# Altium project MotorBoard .PrjPcb
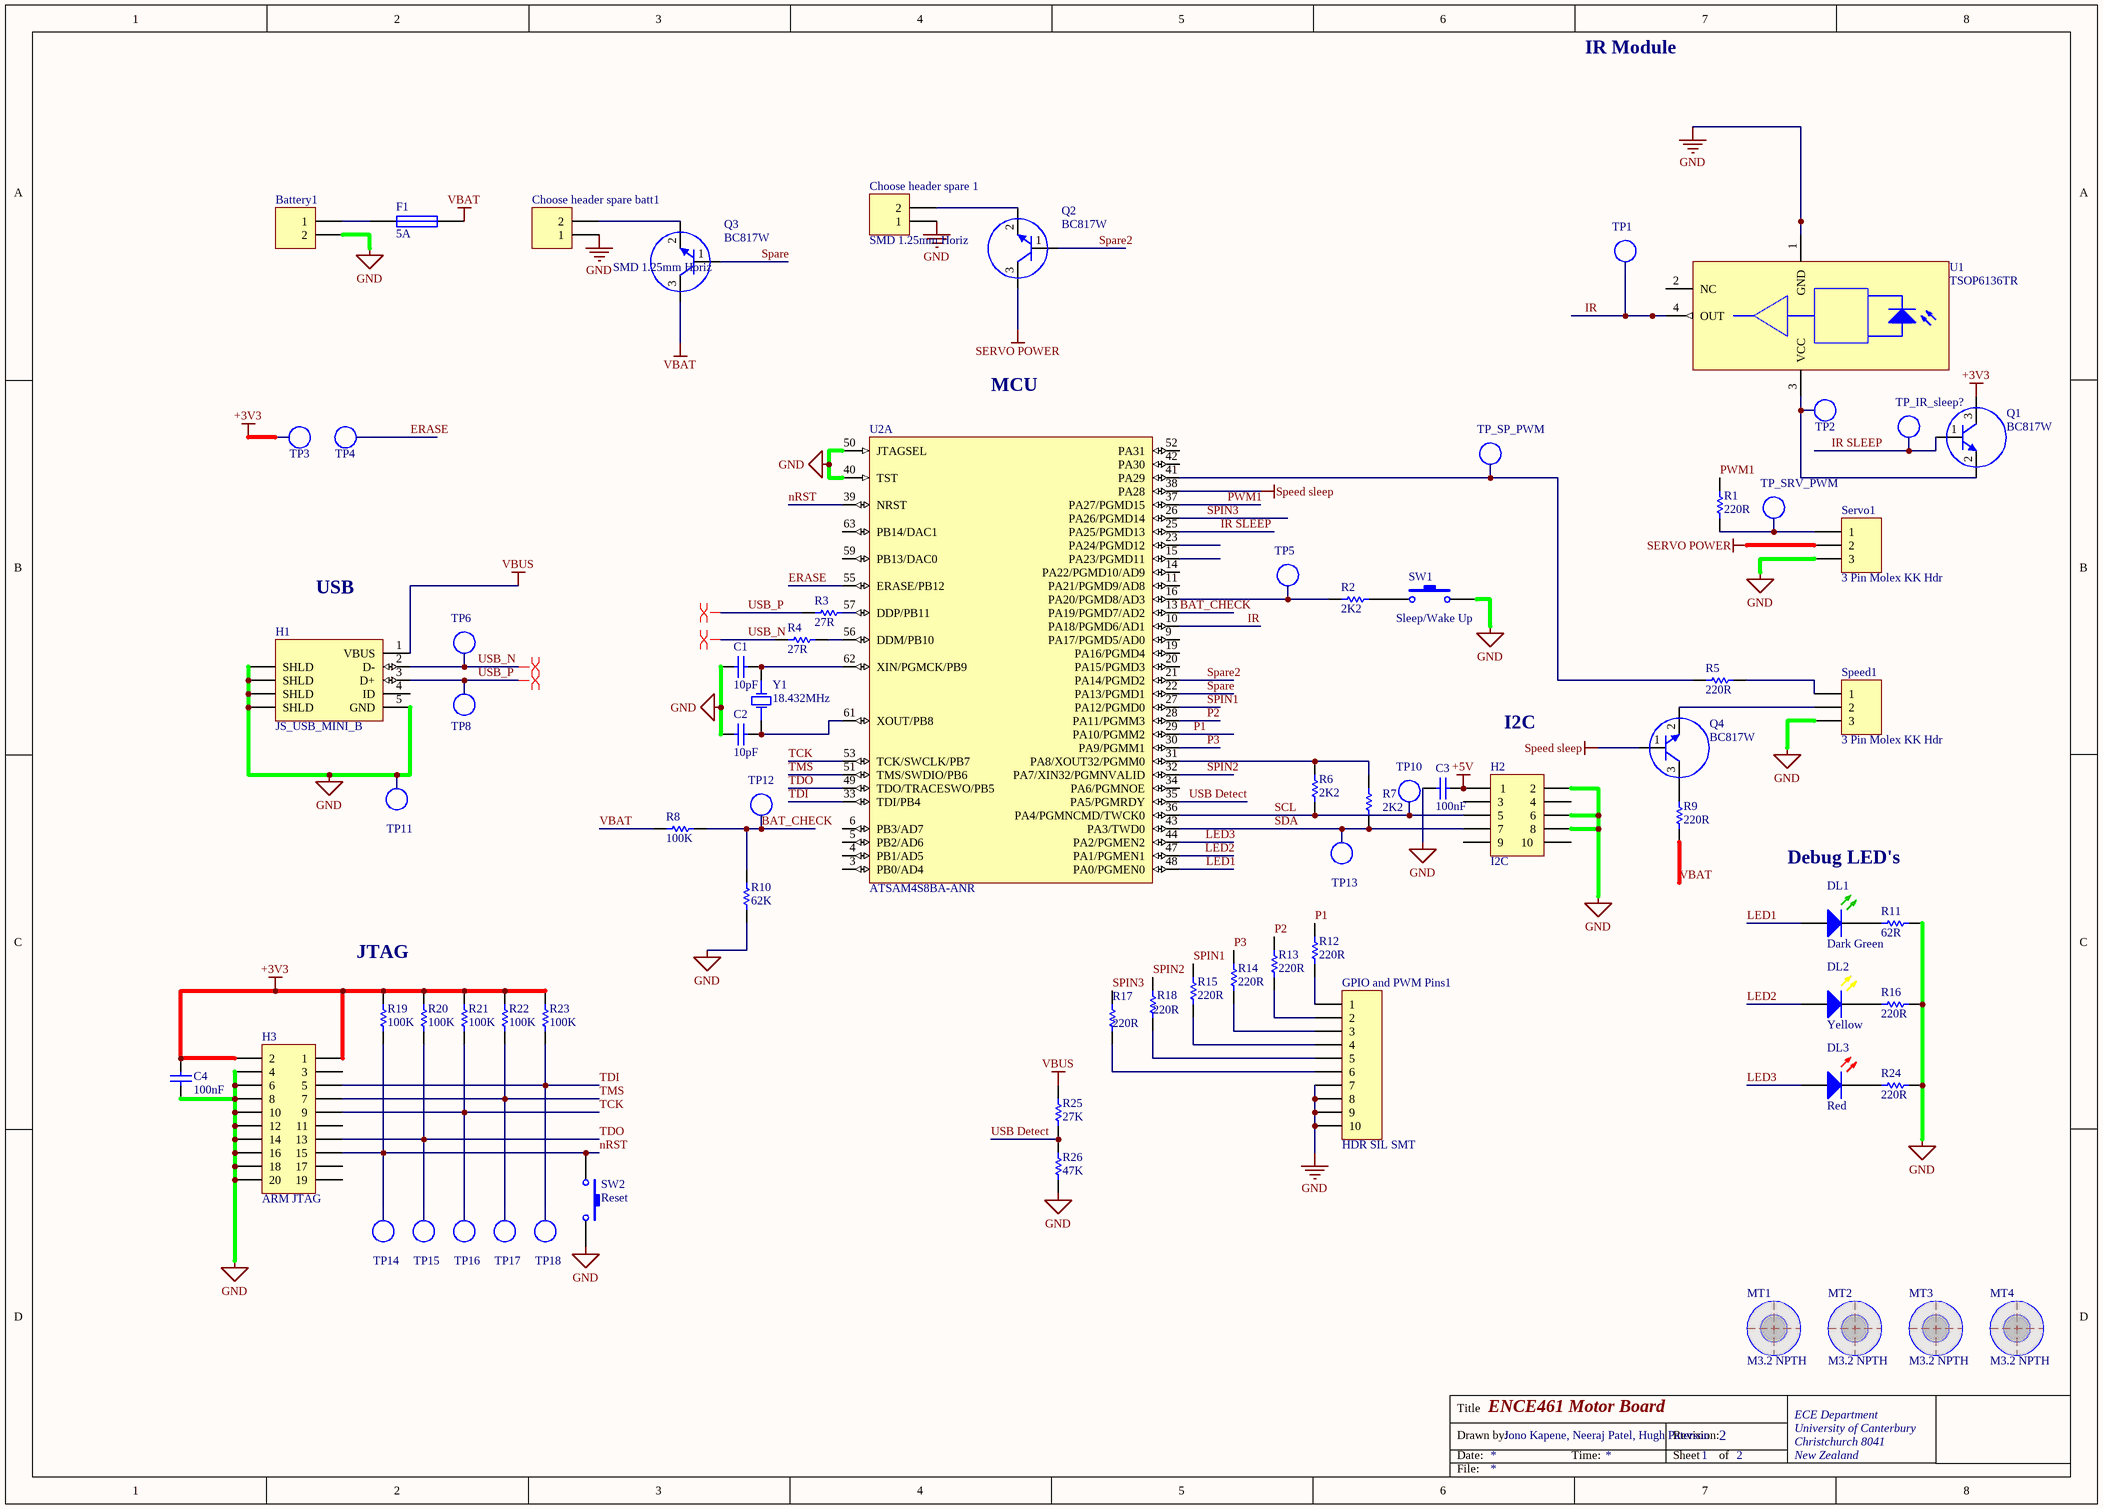
[diagram p0: MotorBoard.SchDoc]
2 sheets, 113 parts. Net scope: global (net labels, ports and power ports of the same name join across sheets).
Board files: Take 3 85 X 80mm.PcbDoc, MotorBoard.PcbDoc, real man's pcb.PcbDoc
Sheets:
  MotorBoard.SchDoc
  MotorBoard_PowerDistribution.SchDoc

## Sheet MotorBoard.SchDoc: ENCE461 Motor Board
size A3; DrawnBy: Jono Kapene, Neeraj Patel, Hugh Paterson; Address1: ECE Department; Address2: University of Canterbury; Address3: Christchurch 8041; Address4: New Zealand; Revision: 2; SheetNumber: 1; SheetTotal: 2; PageSetup: Record=PageOptions|CenterHorizontal=True|CenterVertical=True|PrintScale=1.01|XCorrection=1.00|YCorrection=1.00|PrintKind=0|BorderSize=5000000|LeftOffset=0|BottomOffset=0|Orientation=2|PaperLength=4200|PaperWidth=2970|Scale=100|PaperSource=7|PrintQuality=600|MediaType=1|DitherType=10|PrintScaleMode=1|PaperKind=A3 (297 x 420 mm)|PaperIndex=8

### Parts
Battery1  JA_TERM_BLK_HDR_2 PIN  [TMHDR2]  (value not drawn)
C1  10pF  [CAPC1608L]
C2  10pF  [CAPC1608L]
C3  100nF  [CAPC1608L]
C4  100nF  [CAPC1608L]
Choose_header_spare_1  SMD 1.25mm Horiz  [SD-53261-0219]
Choose_header_spare_batt1  SMD 1.25mm Horiz  [SD-53261-0219]
DL1  Dark Green  [WL-SMCW0603]
DL2  Yellow  [WL-SMCW0603]
DL3  Red  [WL-SMCW0603]
F1  5A  [RESC3216N]
GPIO_and_PWM_Pins1  HDR SIL SMT  [M52-040000P1045]
H1  JS_USB_MINI_B  [USB/SM0.8-6H5]
H2  I2C  [188275-10]
H3  ARM JTAG  [188275-20]
IR_sleep  USB_N  [TP_0805]  (value not drawn)
MT1  M3.2 NPTH  [MNT-HOLE_3.2mm_NPTH]  (no BOM)
MT2  M3.2 NPTH  [MNT-HOLE_3.2mm_NPTH]  (no BOM)
MT3  M3.2 NPTH  [MNT-HOLE_3.2mm_NPTH]  (no BOM)
MT4  M3.2 NPTH  [MNT-HOLE_3.2mm_NPTH]  (no BOM)
Q1  BC817W  [SOT323_M]
Q2  BC817W  [SOT323_M]
Q3  BC817W  [SOT323_M]
Q4  BC817W  [SOT323_M]
R1  220R  [RESC1608L]
R2  2K2  [RESC1608L]
R3  27R  [RESC1608L]
R4  27R  [RESC1608L]
R5  220R  [RESC1608L]
R6  2K2  [RESC1608L]
R7  2K2  [RESC1608L]
R8  100K  [RESC1608L]
R9  220R  [RESC1608L]
R10  62K  [RESC1608L]
R11  62R  [RESC1608L]
R12  220R  [RESC1608L]
R13  220R  [RESC1608L]
R14  220R  [RESC1608L]
R15  220R  [RESC1608L]
R16  220R  [RESC1608L]
R17  220R  [RESC1608L]
R18  220R  [RESC1608L]
R19  100K  [RESC1608L]
R20  100K  [RESC1608L]
R21  100K  [RESC1608L]
R22  100K  [RESC1608L]
R23  100K  [RESC1608L]
R24  220R  [RESC1608L]
R25  27K  [RESC1608N]
R26  47K  [RESC1608N]
Servo1  3 Pin Molex KK Hdr  [MOLEX_KK_3_HDR]
Speed1  3 Pin Molex KK Hdr  [MOLEX_KK_3_HDR]
SW1  Sleep/Wake Up  [KSR211G]
SW2  Reset  [KSR211G]
TP1  Gnd  [TP_0805]  (value not drawn)
TP2  USB_N  [TP_0805]  (value not drawn)
TP3  3V3  [TP_0805]  (value not drawn)
TP4  Erase  [TP_0805]  (value not drawn)
TP5  USB_N  [TP_0805]  (value not drawn)
TP6  USB_N  [TP_0805]  (value not drawn)
TP8  USB_P  [TP_0805]  (value not drawn)
TP10  USB_N  [TP_0805]  (value not drawn)
TP11  USB_N  [TP_0805]  (value not drawn)
TP12  USB_N  [TP_0805]  (value not drawn)
TP13  USB_N  [TP_0805]  (value not drawn)
TP14  nRST  [TP_0805]  (value not drawn)
TP15  TDO  [TP_0805]  (value not drawn)
TP16  TCK  [TP_0805]  (value not drawn)
TP17  TMS  [TP_0805]  (value not drawn)
TP18  TDI  [TP_0805]  (value not drawn)
TP_SP_PWM  USB_N  [TP_0805]  (value not drawn)
TP_SRV_PWM  USB_N  [TP_0805]  (value not drawn)
U1  TSOP6136TR  [PCBComponent_1]
U2  ATSAM4S8BA-ANR  [LQFP64_L]  (part A of 2)
Y1  18.432MHz  [6.0X3.5-4]

### Nets
+3V3: C4.2 H3.1 H3.2 Q1.3 R19.2 R20.2 R21.2 R22.2 R23.2 TP3.1(TP)
+5V: C3.2 H2.1
GND: Battery1.2 C1.1 C2.1 C3.1 C4.1 Choose_header_spare_1.1 Choose_header_spare_batt1.1 GPIO_and_PWM_Pins1.7 GPIO_and_PWM_Pins1.8 GPIO_and_PWM_Pins1.9 GPIO_and_PWM_Pins1.10 H1.5(GND) H1.6(SHLD) H1.7(SHLD) H1.8(SHLD) H1.9(SHLD) H2.2 H2.6 H2.8 H3.4 H3.6 H3.8 H3.10 H3.12 H3.14 H3.16 H3.18 H3.20 R10.1 R11.2 R16.2 R24.2 R26.1 Servo1.3 Speed1.3 SW1.2 SW2.2 TP11.1(TP) U1.1(GND) U2.40(TST) U2.50(JTAGSEL)
SERVO POWER: Q2.3 Servo1.2
Speed sleep: Q4.1 U2.38(PA28)
VBAT: F1.2 Q3.3 R8.1 R9.2
VBUS: H1.1(VBUS) R25.2
BAT_CHECK: R8.2 R10.2 TP12.1(TP) U2.13(PA19/PGMD7/AD2)
ERASE: TP4.1(TP) U2.55(ERASE/PB12)
IR: TP1.1(TP) U1.4(OUT) U2.10(PA18/PGMD6/AD1)
IR SLEEP: IR_sleep.1(TP) Q1.1 U2.25(PA25/PGMD13)
LED1: DL1.2(A) U2.48(PA0/PGMEN0)
LED2: DL2.2(A) U2.47(PA1/PGMEN1)
LED3: DL3.2(A) U2.44(PA2/PGMEN2)
nRST: H3.15 R19.1 SW2.1 TP14.1(TP) U2.39(NRST)
P1: R12.1 U2.29(PA10/PGMM2)
P2: R13.2 U2.28(PA11/PGMM3)
P3: R14.2 U2.30(PA9/PGMM1)
PWM1: R1.2 U2.37(PA27/PGMD15)
SCL: H2.5 R6.1 TP10.1(TP) U2.36(PA4/PGMNCMD/TWCK0)
SDA: H2.7 R7.1 TP13.1(TP) U2.43(PA3/TWD0)
Spare: Q3.1 U2.22(PA13/PGMD1)
Spare2: Q2.1 U2.21(PA14/PGMD2)
SPIN1: R15.2 U2.27(PA12/PGMD0)
SPIN2: R18.2 U2.32(PA7/XIN32/PGMNVALID)
SPIN3: R17.2 U2.26(PA26/PGMD14)
TCK: H3.9 R21.1 TP16.1(TP) U2.53(TCK/SWCLK/PB7)
TDI: H3.5 R23.1 TP18.1(TP) U2.33(TDI/PB4)
TDO: H3.13 R20.1 TP15.1(TP) U2.49(TDO/TRACESWO/PB5)
TMS: H3.7 R22.1 TP17.1(TP) U2.51(TMS/SWDIO/PB6)
USB Detect: R25.1 R26.2 U2.35(PA5/PGMRDY)
USB_N: H1.2(D-) R4.1 TP6.1(TP)
USB_P: H1.3(D+) R3.1 TP8.1(TP)
NetBattery1_1: Battery1.1 F1.1
NetC1_2: C1.2 U2.62(XIN/PGMCK/PB9) Y1.3(OSC2)
NetC2_2: C2.2 U2.61(XOUT/PB8) Y1.1(OSC1)
NetChoose_header_spare_1_2: Choose_header_spare_1.2 Q2.2
NetChoose_header_spare_batt1_2: Choose_header_spare_batt1.2 Q3.2
NetDL1_1: DL1.1(K) R11.1
NetDL2_1: DL2.1(K) R16.1
NetDL3_1: DL3.1(K) R24.1
NetGPIO_and_PWM_Pins1_1: GPIO_and_PWM_Pins1.1 R12.2
NetGPIO_and_PWM_Pins1_2: GPIO_and_PWM_Pins1.2 R13.1
NetGPIO_and_PWM_Pins1_3: GPIO_and_PWM_Pins1.3 R14.1
NetGPIO_and_PWM_Pins1_4: GPIO_and_PWM_Pins1.4 R15.1
NetGPIO_and_PWM_Pins1_5: GPIO_and_PWM_Pins1.5 R18.1
NetGPIO_and_PWM_Pins1_6: GPIO_and_PWM_Pins1.6 R17.1
NetQ1_2: Q1.2 TP2.1(TP) U1.3(VCC)
NetQ4_2: Q4.2 Speed1.2
NetQ4_3: Q4.3 R9.1
NetR1_1: R1.1 Servo1.1 TP_SRV_PWM.1(TP)
NetR2_1: R2.1 TP5.1(TP) U2.16(PA20/PGMD8/AD3)
NetR2_2: R2.2 SW1.1
NetR3_2: R3.2 U2.57(DDP/PB11)
NetR4_2: R4.2 U2.56(DDM/PB10)
NetR5_1: R5.1 TP_SP_PWM.1(TP) U2.41(PA29)
NetR5_2: R5.2 Speed1.1
NetR6_2: R6.2 R7.2 U2.31(PA8/XOUT32/PGMM0)

Not connected (* = marked no-connect by the designer): H1 4(ID); H2 3 4 9 10; H3 3 11 17 19; U1 2(NC); U2 3(PB0/AD4) 4(PB1/AD5) 5(PB2/AD6) 6(PB3/AD7) 9(PA17/PGMD5/AD0) 11(PA21/PGMD9/AD8) 14(PA22/PGMD10/AD9) 15(PA23/PGMD11) 19(PA16/PGMD4) 20(PA15/PGMD3) 23(PA24/PGMD12) 34(PA6/PGMNOE) 42(PA30) 52(PA31) 59(PB13/DAC0) 63(PB14/DAC1)

### Layout directives
differential pair: USB_N, USB_P

### Notes on the sheet
- IR Module
- MCU
- USB
- I2C
- Debug LED's
- JTAG
- Title
- Drawn by:
- Date:
- Time:
- Revision:
- Sheet
- of
- File:

### Library data of the parts
Battery1 = JA_TERM_BLK_HDR_2 PIN: TERM_BLK_HEADER 5.08mm 2 Pos R/A Thru Hole; Manufacturer: *; Verify: *; Supplier Part Number 1: 3704579; Supplier: ECE Dept; Supplier 1: Farnell; Storage Location: ECE Dept Store
C1 C2 = CC_10pF_0603: CAP CER 10pF COG/NPO 50V 0603; PackageReference: 0603; Code_IPC: 1005 [0402]; Verify: *; Supplier: ECE Dept; Storage Location: PCB Assembly WS; Value: 10pF
C3 C4 = CC_100nF_0603: CAP CER 100nF X7R +-10% 50V 0603; PackageReference: 0603; Code_IPC: 1608 [0603]; Verify: *; Supplier: ECE Dept; Storage Location: PCB Assembly WS; Value: 100nF
Choose_header_spare_1 Choose_header_spare_batt1 = JB_53261-02: Header_Horiz_2Pos_1.25mm_125V@1A_SMT; Manufacturer: MOLEX; Manufacturer Part Number: 53261-0271; External Depth: 4.2; External Length / Height: 3.4; Gender: Header; No. of Contacts: 2; Pitch Spacing: 1.25; Voltage Rating V AC: 125; Contact Termination: Surface Mount Right Angle; Lead Spacing: 1.25; Series: PicoBlade; Pricing: 5=0.27, 100=0.255, 250=0.245, 500=0.225, 1000=0.205 (NZD); Supplier 1: Farnell; Supplier Part Number 1: 1125373; Supplier 2: Digi-Key; Supplier Part Number 2: WM7620CT-ND; Supplier: ECE Dept; Storage Location: PCB Assembly WS; Value: SMD 1.25mm Horiz
DL1 = DL_150060GS75000: LED Dk Green 430mcd 0603 SMD; Manufacturer: WURTH ELEKTRONIK; Forward Current If: 30; Wavelength Typ: 520; Forward Voltage: 3.2; Lens Shape: Rectangular; Luminous Intensity: 430; Viewing Angle: 140°; LED Mounting: SMD; Supplier 1: Farnell; Supplier Part Number 1: 2322070; Manufacturer Part Number: 150060GS75000; Storage Location: PCB Assembly WS; Supplier: ECE Dept; LED Colour: Dark Green
DL2 = DL_150060YS75000: LED Yellow 120mcd 0603 SMD; Manufacturer: WURTH ELEKTRONIK; Forward Current If: 30; Forward Voltage: 2; Wavelength Typ: 590; Lens Shape: Rectangular; Viewing Angle: 140°; Luminous Intensity: 120; LED Mounting: SMD; Supplier 1: Farnell; Supplier Part Number 1: 2322074; Manufacturer Part Number: 150060YS75000; Storage Location: PCB Assembly WS; Supplier: ECE Dept; LED Colour: Yellow
DL3 = DL_150060RS75000: LED Red 250mcd 0603 SMD; Manufacturer: WURTH ELEKTRONIK; Forward Current If: 30; Forward Voltage: 2; Lens Shape: Rectangular; Luminous Intensity: 250; Wavelength Typ: 625; Viewing Angle: 140°; LED Mounting: SMD; Supplier 1: Farnell; Supplier Part Number 1: 2322071; Manufacturer Part Number: 150060RS75000; Storage Location: PCB Assembly WS; Supplier: ECE Dept; LED Colour: Red
F1 = FS_Fuse_5.0A: Fuse 5.0A Very Fast Acting 1206 SMD; Manufacturer: MULTICOMP; Manufacturer PN: MC12CF-005; Manufacturer Part Number: MC12CF 005; Breaking Capacity: 50A @ 32V AC / 63; Device Marking: T; Fuse Case Style: 1206; Fuse Current: 5; Supplier: ECE Dept; Storage Location: PCB Assembly WS; Blow Characteristic: Very Fast Acting; Fuse Type Blowing Characteristic: Very Fast Acting; Supplier 1: Farnell; Supplier Part Number 1: 1841033; Value: 5A
GPIO_and_PWM_Pins1 = JB_M52H_10_1.27: Header 1.27mm Pitch SIL 10 Way SMT; Manufacturer: HARWIN; Contact Termination: Surface Mount Vertical; Current Rating: 1; No. of Poles: 10; Pitch Spacing: 1.27; Gender: Header; Lead Spacing: 1.27; No. of Rows: 1; Supplier 1: Farnell; Supplier Part Number 1: 1099570; Manufacturer Part Number: M52-040000P1045; Storage Location: PCB Assembly WS; Supplier: ECE Dept
H1 = JS_USB_MINI_B_SMT: USB 2.0, Right Angle, SMT, B Type, Receptacle, 5 Position,; Manufacturer: FCI; Manufacturer PN: 10033526-N3212MLF; Supplier 1: Farnell; Supplier Part Number 1: 1824416; Storage Location: PCB Assembly WS; Supplier: ECE Dept
H2 = JB_HDR_IDC_5X2_VERT: IDC Header, 1,27mm, 10-Pin, Vert, SMT; Manufacturer: TE Connectivity; Manufacturer Part Number: 1-188275-0; Current Rating: 1.5 A; Mounting Angle: Vertical; Number of Positions / Contacts: 10; Pitch: 1.27 mm; Supplier: ECE Dept; Mounting Style: SMD/SMT; Storage Location: PCB Assembly WS; Supplier 1: Digi-Key; Supplier Part Number 1: A99476TR-ND
H3 = JB_HDR_IDC_10X2_VERT: IDC Header, 1,27mm, 20-Pin, Vert, SMT; Manufacturer: TE Connectivity; Manufacturer Part Number: 2-188275-0; Mounting Angle: Vertical; Number of Positions / Contacts: 20; Pitch: 1.27 mm; Mounting Style: SMD/SMT; Supplier: ECE Dept; Storage Location: PCB Assembly WS; Supplier 1: Digi-Key; Supplier Part Number 1: A99481CT-ND
IR_sleep TP1-TP6 TP8 TP10-TP18 TP_SP_PWM TP_SRV_PWM = TP_0805: Test Point 2.0X0.9X1.2mm SMD; Manufacturer: TE Connectivity AMP Connectors; Manufacturer Part Number: 1625854-2
MT1-MT4 = MC_M3.2_HOLE: Fixing M3.2 Mount Hole NPTH; Manufacturer: Hi-Q; Manufacturer PN: 3BV series M3 Clearance; price: 0; Supplier: ECE Dept; value: M3.2 NPTH
Q1-Q4 = TB_BC817W: NPN GP Bipolar Transistor 45V 500mA SOT323; Manufacturer: NXP; Supplier 1: Farnell; Supplier Part Number 1: 2114873; Manufacturer PN: BC817W; Storage Location: PCB Assembly WS; Supplier: ECE Dept; Value: BC817W
R1 R5 R9 R12-R18 R24 = RS_220R: RES 220 OHM 1/10W 5% 0603 SMD; Storage Location: PCB Assembly WS; Supplier: ECE Dept; Value: 220R
R2 R6 R7 = RS_2K2: RES 2.2K OHM 1/10W 5% 0603 SMD; Storage Location: PCB Assembly WS; Supplier: ECE Dept; Value: 2K2
R3 R4 = RS_27R: RES 27 OHM 1/10W 5% 0603 SMD; Storage Location: PCB Assembly WS; Supplier: ECE Dept; Value: 27R
R8 R19-R23 = RS_100K: RES 100K OHM 1/10W 5% 0603 SMD; Storage Location: PCB Assembly WS; Supplier: ECE Dept; Value: 100K
R10 = RS_62K: RES 62.0K OHM 1/10W 5% 0603 SMD; Storage Location: PCB Assembly WS; Supplier: ECE Dept; Value: 62K
R11 = RS_62R: RES 62 OHM 1/10W 5% 0603 SMD; Storage Location: PCB Assembly WS; Supplier: ECE Dept; Value: 62R
R25 = RS_27K: RES 27K OHM 1/10W 5% 0603 SMD; Storage Location: PCB Assembly WS; Supplier: ECE Dept; Value: 27K
R26 = RS_47K: RES 47.0K OHM 1/10W 5% 0603 SMD; Storage Location: PCB Assembly WS; Supplier: ECE Dept; Value: 47K
Servo1 Speed1 = JA_MOLEX_KK_3POS: CONN HEADER 3POS 2.54mm VERT_Thru Hole; Manufacturer: Molex; Manufacturer PN: 22-23-2031; Supplier Part Number 1: 9731156; Supplier: ECE Dept; Supplier 1: Farnell; Storage Location: ECE Dept Store; Value: 3 Pin Molex KK Hdr
SW1 SW2 = WS_KSR211G LFS: SWITCH TACTILE SPST-NO SMD; Manufacturer: C & K COMPONENTS; Contact Current Max: 50; Contact Resistance: 100; Contact Voltage DC Nom: 32; Operating Force: 1.8; Contact Configuration: SPST-NO; Pricing: 1=0.538, 50=0.477, 100=0.416, 2500=0.219 (NZD); Supplier 1: Farnell; Supplier Part Number 1: 1437634; Storage Location: PCB Assembly WS; Supplier: ECE Dept; Manufacturer Part Number: KSR211G LFS
U1 = TSOP6136TR: Infrared Receiver 36KHz; Manufacturer: Vishay Semiconductor Opto Division; Supplier 1: Farnell; Supplier Part Number 1: 1779685; Manufacturers PN: TSOP6136TR; Manufacturer Part Number: TSOP6136TR; Supplier 2: Digi-Key; Supplier Part Number: TSOP6136TR-ND; Supplier Part Number 2: TSOP6136TR-ND
U2 = SE_ATSAM4S16BA-MU: IC MCU 32BIT 512KB FLASH 64LQFP; Manufacturer: Atmel; Connectivity: I²C, IrDA, Memory Card, SPI, SSC, UART/USART, USB; Core Processor: ARM® Cortex®-M4; Core Size: 32-Bit; Data Converters: A/D 11x12b, D/A 2x12b; Number of I/O: 47; Peripherals: Brown-out Detect/Reset, DMA, POR, PWM, WDT; Program Memory Size: 512KB (512K x 8); RAM Size: 128K x 8; Speed: 120MHz; Voltage - Supply (Vcc/Vdd): 1.62 V ~ 3.6 V; PackageVersion: revJ, Jul-2007; PackageReference: 64PS; PackageDescription: 64-Pin Quad Flat No-Lead (QFN) Sawn, 9 x 9 x 1.0 mm Body, 0.5 mm Pitch, Exposed Pad; Code_JEDEC: MO-220VMMD-3; ComponentLink1Description: Manufacturer URL; ComponentLink1URL: http://www.atmel.com/; ComponentLink2Description: SAM4S Series Datasheet; ComponentLink2URL: http://www.atmel.com/dyn/resources/prod_documents/11100.pdf; ComponentLink3Description: SAM4S Series Summary; ComponentLink3URL: http://www.atmel.com/dyn/resources/prod_documents/11100S.pdf; Supplier 1: Digi-Key; Package / Case: 64-LQFP; Packaging: Cut Tape (CT); Program Memory Type: FLASH; Supplier Part Number 1: ATSAM4S8BA-ANRCT-ND; Manufacturer Part Number: ATSAM4S8BA-ANR
Y1 = XT_CRYSTAL_18.432MHz_13pF: 18.432 MHZ 4PF  6.0X3.5mm SMD; Manufacturer: CTS-Frequency Controls; Manufacturer Part Number: 406C35B18M43200; ESR (Equivalent Series Resistance): 40 Ohm; Frequency Stability: ±50ppm; Frequency Tolerance: ±30ppm; Load Capacitance: 13pF; Supplier 1: Digi-Key; Height: 0.047" (1.20mm); Mounting Type: Surface Mount; Package / Case: 4-SMD, No Lead (DFN, LCC); Size / Dimension: 0.236" L x 0.138" W (6.00mm x 3.50mm); Supplier Part Number 1: CTX668CT-ND; Frequency: 18.432MHz

## Sheet MotorBoard_PowerDistribution.SchDoc: ENCE461 Motor Board Power Distribution
size A3; DrawnBy: Jono Kapene, Neeraj Patel, Hugh Paterson; Address1: ECE Department; Address2: University of Canterbury; Address3: Christchurch 8041; Address4: New Zealand; Revision: 2; SheetNumber: 2; SheetTotal: 2; PageSetup: Record=PageOptions|CenterHorizontal=True|CenterVertical=True|PrintScale=1.01|XCorrection=1.00|YCorrection=1.00|PrintKind=0|BorderSize=5000000|LeftOffset=0|BottomOffset=0|Orientation=2|PaperLength=4200|PaperWidth=2970|Scale=100|PaperSource=7|PrintQuality=600|MediaType=1|DitherType=10|PrintScaleMode=1|PaperKind=A3 (297 x 420 mm)|PaperIndex=8
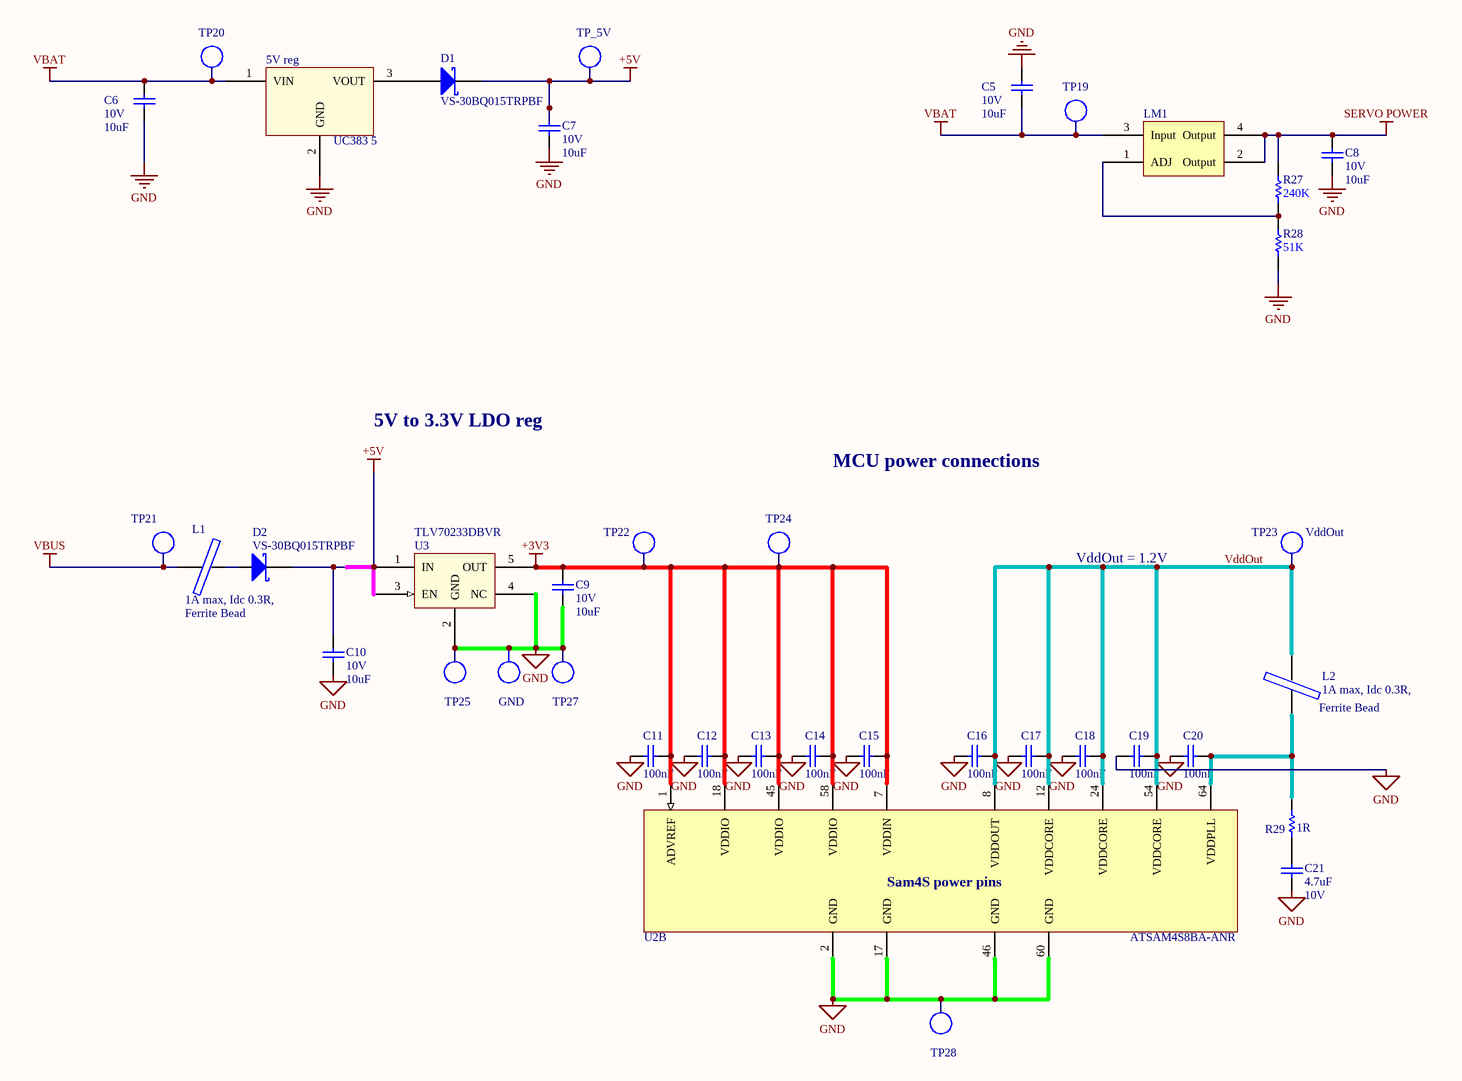
[diagram p1: MotorBoard_PowerDistribution.SchDoc]

### Parts
5V_reg  UC383 5  [UC383-5]
C5  Voltage - Rated: 10V  [CAPC1608L]  (hidden comment: 10uF)
C6  Voltage - Rated: 10V  [CAPC1608L]  (hidden comment: 10uF)
C7  Voltage - Rated: 10V  [CAPC1608L]  (hidden comment: 10uF)
C8  Voltage - Rated: 10V  [CAPC1608L]  (hidden comment: 10uF)
C9  Voltage - Rated: 10V  [CAPC1608L]  (hidden comment: 10uF)
C10  Voltage - Rated: 10V  [CAPC1608L]  (hidden comment: 10uF)
C11  100nF  [CAPC1608L]
C12  100nF  [CAPC1608L]
C13  100nF  [CAPC1608L]
C14  100nF  [CAPC1608L]
C15  100nF  [CAPC1608L]
C16  100nF  [CAPC1608L]
C17  100nF  [CAPC1608L]
C18  100nF  [CAPC1608L]
C19  100nF  [CAPC1608L]
C20  100nF  [CAPC1608L]
C21  Max Voltage: 10V  [CAPC1608N]  (hidden comment: 4.7uF)
D1  VS-30BQ015TRPBF  [SMC]
D2  VS-30BQ015TRPBF  [SMC]
GND  TP  [TP_1206]  (value not drawn)  (no BOM)
L1  Ferrite Bead  value 1A max, Idc 0.3R,  [INDC3216L]
L2  Ferrite Bead  value 1A max, Idc 0.3R,  [INDC3216L]
LM1  Surface mount regulator, texas instruments  [LM317]  (value not drawn)
R27  240K  [RESC1608L]
R28  51K  [RESC1608L]
R29  1R  [RESC3216L]
TP19  USB_N  [TP_0805]  (value not drawn)
TP20  USB_N  [TP_0805]  (value not drawn)
TP21  V_Bus  [TP_0805]  (value not drawn)
TP22  3V3  [TP_0805]  (value not drawn)
TP23  VddOut  [TP_0805]
TP24  USB_N  [TP_0805]  (value not drawn)
TP25  Gnd  [TP_0805]  (value not drawn)
TP27  USB_N  [TP_0805]  (value not drawn)
TP28  Gnd  [TP_0805]  (value not drawn)
TP_5V  USB_N  [TP_0805]  (value not drawn)
U2  ATSAM4S8BA-ANR  [LQFP64_L]  (part B of 2)
U3  TLV70233DBVR  [SOT95P280X145-5N]

### Nets
+3V3: C9.1 C11.2 C12.2 C13.2 C14.2 C15.2 TP22.1(TP) TP24.1(TP) U2.1(ADVREF) U2.7(VDDIN) U2.18(VDDIO) U2.45(VDDIO) U2.58(VDDIO) U3.5(OUT)
+5V: C7.1 C10.1 D1.2(K) D2.2(K) TP_5V.1(TP) U3.1(IN) U3.3(EN)
GND: 5V_reg.2(GND) C5.1 C6.2 C7.2 C8.2 C9.2 C10.2 C11.1 C12.1 C13.1 C14.1 C15.1 C16.1 C17.1 C18.1 C19.1 C20.1 C21.1 GND.1 R28.1 TP25.1(TP) TP27.1(TP) TP28.1(TP) U2.2(GND) U2.17(GND) U2.46(GND) U2.60(GND) U3.2(GND) U3.4(NC)
SERVO POWER: C8.1 LM1.2(Output) LM1.4(Output) R27.2
VBAT: 5V_reg.1(VIN) C5.2 C6.1 LM1.3(Input) TP19.1(TP) TP20.1(TP)
VBUS: L1.1 TP21.1(TP)
VddOut: C16.2 C17.2 C18.2 C19.2 L2.2 TP23.1(TP) U2.8(VDDOUT) U2.12(VDDCORE) U2.24(VDDCORE) U2.54(VDDCORE)
Net5V_reg_3: 5V_reg.3(VOUT) D1.1(A)
NetC20_2: C20.2 L2.1 R29.2 U2.64(VDDPLL)
NetC21_2: C21.2 R29.1
NetD2_1: D2.1(A) L1.2
NetLM1_1: LM1.1(ADJ) R27.1 R28.2

### Notes on the sheet
- 5V to 3.3V LDO reg
- MCU power connections
- VddOut = 1.2V
- (near U2) Sam4S power pins
- Title
- Drawn by:
- Date:
- Time:
- Revision:
- Sheet
- of
- File:

### Library data of the parts
C5-C10 = CC_10uF_0603: CAP CER 10UF X5R +-20% 10V 0603; Supplier: ECE Dept; Storage Location: PCB Assembly WS; Value: 10uF
C11-C20 = CC_100nF_0603: CAP CER 100nF X7R +-10% 50V 0603; PackageReference: 0603; Code_IPC: 1608 [0603]; Verify: *; Supplier: ECE Dept; Storage Location: PCB Assembly WS; Value: 100nF
C21 = CC_4.7uF_0603: CAP CER 4.7uF X5R +-20%  10V 0603; Note: Footprint corresponds to dimensions for bulk cassette packaging. This case size has tightened tolerances.; PackageReference: 0805; Code_IPC: 2012[0805]; Verify: *; Supplier: ECE Dept; Storage Location: PCB Assembly WS; Value: 4.7uF
D1 D2 = DS_VS-30BQD015TRPBF: DIODE SCHOTTKY 15V 3A SMC; Manufacturer: Vishay Semiconductor Diodes Division; Current - Reverse Leakage @ Vr: 4mA @ 15V; Voltage - Forward (Vf) (Max) @ If: 350mV @ 3A; Current - Average Rectified (Io): 3A; Package / Case: DO-214AB, SMC; Pricing: 1=1.59, 10=1.417, 25=1.2504, 100=1.1253, 250=0.97944, 500=0.87526, 1000=0.6877 (NZD); Supplier 1: Digi-Key; Supplier Part Number 1: 30BQ015PBFCT-ND; Supplier 2: Farnell; Supplier Part Number 2: 9101250; Supplier 3: Mouser; Supplier Part Number 3: N/A; Storage Location: PCB Assembly WS; Supplier: ECE Dept; Manufacturer Part Number: VS-30BQ015TRPBF
GND = TP_1206: Test-Point 3.3x1.6x2.1mm SMD; Manufacturer: Harwin Inc; Manufacturer Part Number: S1751-46R; Manufacturer PN: *; Storage Location: ProtoPlace; Mounting Type: Surface Mount; Type: PC Test Point; Supplier 1: Digi-Key; Supplier Part Number 1: 952-1478-2-ND; Supplier 2: Farnell; Supplier Part Number 2: 1826282; Supplier: ECE Dept; Value: TP
L1 L2 = IN_Ferrite-Bead: Ferrite Bead, Rdc 0.3R, Z100MHZ 600R, Imax 1A, SMD 1206; Manufacturer: FAIR-RITE; Manufacturer PN: 2512066017Y1; DC Current Rating: 1; DC Resistance Max: 0.08; Ferrite Case Style: 1206 ^3216 Metric]; Frequency Range: 50MHz to 1; Impedance: 600; Impedance Tolerance: ± 25%; Supplier: ECE Dept; Storage Location: PCB Assembly WS; Ferrite Mounting: SMD; Supplier 1: Farnell; Supplier Part Number 1: 1612060; Manufacturer Part Number: 2512066017Y1
LM1 = LM317 ADJ
R27 = RS_240K: RES 240K OHM 1/10W 5% 0603 SMD; Storage Location: PCB Assembly WS; Supplier: ECE Dept; Value: 240K
R28 = RS_51K: RES 51.0K OHM 1/10W 5% 0603 SMD; Storage Location: PCB Assembly WS; Supplier: ECE Dept; Value: 51K
R29 = RT_1R: RES 1R OHM 1/4W 5% 1206 SMD; Storage Location: PCB Assembly WS; Supplier: ECE Dept; Value: 1R
TP19-TP25 TP27 TP28 TP_5V = TP_0805: as IR_sleep on sheet MotorBoard; Supplier 1: Digi-Key; Mounting Type: Surface Mount; Terminal: 0.079" x 0.049" x 0.057" (2.00mm x 1.25mm x 1.45mm); Type: PC Test Point; Supplier Part Number 1: A106144CT-ND
U2 = SE_ATSAM4S16BA-MU: as U2 on sheet MotorBoard; PackageVersion: revJ, Jul-2007; PackageReference: 64PS; PackageDescription: 64-Pin Quad Flat No-Lead (QFN) Sawn, 9 x 9 x 1.0 mm Body, 0.5 mm Pitch, Exposed Pad; Code_JEDEC: MO-220VMMD-3; ComponentLink1Description: Manufacturer URL; ComponentLink1URL: http://www.atmel.com/; ComponentLink2Description: SAM4S Series Datasheet; ComponentLink2URL: http://www.atmel.com/dyn/resources/prod_documents/11100.pdf; ComponentLink3Description: SAM4S Series Summary; ComponentLink3URL: http://www.atmel.com/dyn/resources/prod_documents/11100S.pdf; Supplier 1: Digi-Key; Package / Case: 64-LQFP; Packaging: Cut Tape (CT); Program Memory Type: FLASH; Supplier Part Number 1: ATSAM4S8BA-ANRCT-ND; Manufacturer Part Number: ATSAM4S8BA-ANR
U3 = SV_TLV70233DBVR: IC REG LDO 3.3V 0.3A SOT23-5; Manufacturer: Texas Instruments; Current - Output: 300mA; Supplier 1: Digi-Key; Operating Temperature: -40°C ~ 125°C; Package / Case: SC-74A, SOT-753; Pricing: 1=0.77, 10=0.647, 25=0.5672, 100=0.4853, 250=0.421, 500=0.35658, 750=0.30789, 1000=0.2749 (NZD); Supplier Part Number 1: 296-32415-1-ND; Manufacturer Part Number: TLV70233DBVR

## Nets that join several sheets
+3V3: MotorBoard (10 pins), MotorBoard_PowerDistribution (14 pins)
+5V: MotorBoard (C3.2 H2.1), MotorBoard_PowerDistribution (7 pins)
GND: MotorBoard (41 pins), MotorBoard_PowerDistribution (29 pins)
SERVO POWER: MotorBoard (Q2.3 Servo1.2), MotorBoard_PowerDistribution (C8.1 LM1.2 LM1.4 R27.2)
VBAT: MotorBoard (F1.2 Q3.3 R8.1 R9.2), MotorBoard_PowerDistribution (6 pins)
VBUS: MotorBoard (H1.1 R25.2), MotorBoard_PowerDistribution (L1.1 TP21.1)